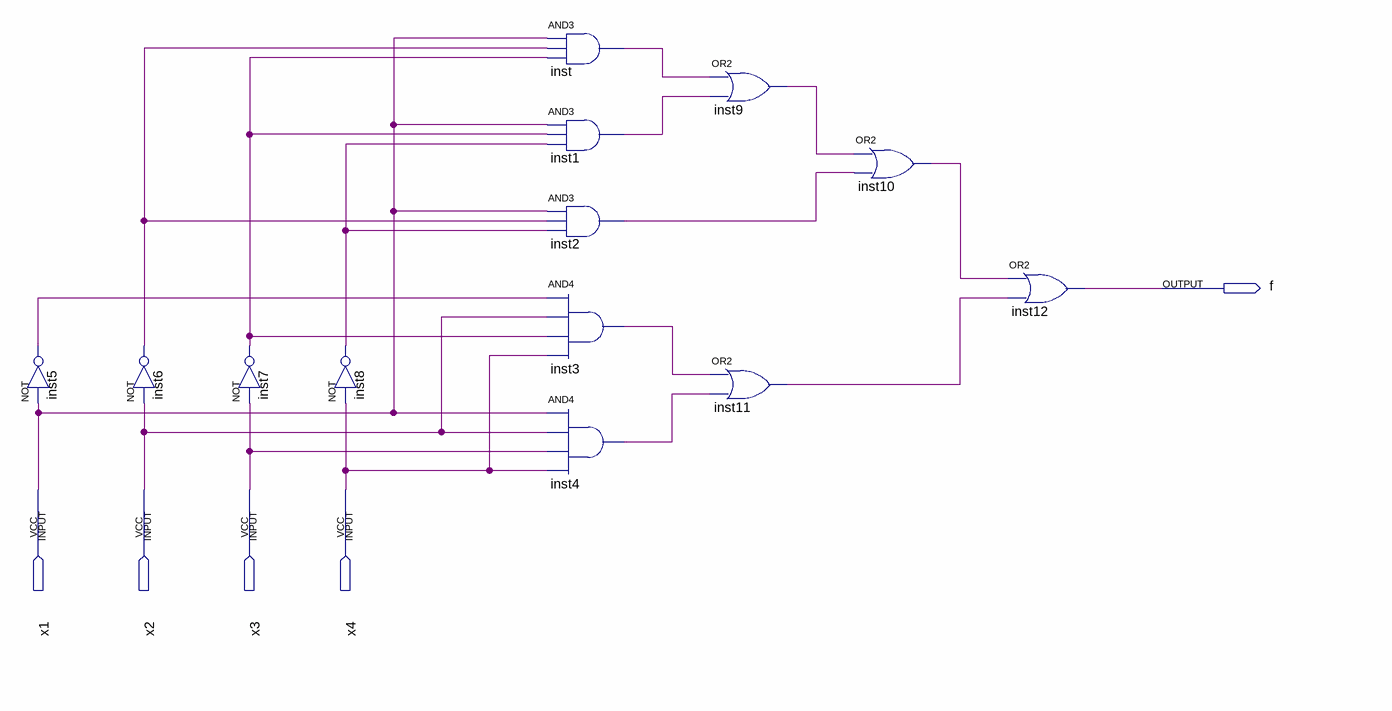
[diagram p0: schematic sheet]
// Quartus schematic Lab2.bdf as structural Verilog: 13 symbols, 5 pins
module Lab2 (
  input  x1,
  input  x2,
  input  x3,
  input  x4,
  output f
);

  wire inst1_out, inst2_out, inst3_out, inst4_out, inst5_out, inst6_out, inst7_out, inst8_out, inst9_out,
       inst10_out, inst11_out, inst_out;

  not inst5 (inst5_out, x1);
  not inst6 (inst6_out, x2);
  not inst7 (inst7_out, x3);
  not inst8 (inst8_out, x4);
  and inst (inst_out, x1, inst6_out, inst7_out);
  and inst1 (inst1_out, x1, inst7_out, inst8_out);
  and inst2 (inst2_out, x1, inst6_out, inst8_out);
  and inst3 (inst3_out, inst5_out, x2, inst7_out, x4);
  and inst4 (inst4_out, x1, x2, x3, x4);
  or inst9 (inst9_out, inst_out, inst1_out);
  or inst11 (inst11_out, inst3_out, inst4_out);
  or inst10 (inst10_out, inst9_out, inst2_out);
  or inst12 (f, inst10_out, inst11_out);
endmodule
